# Altium schematic sheet JTAG_UART.SchDoc: Host Interface: JTAG and UART
size Letter; Engineer: Nathan Petersen; DocumentNumber: 21; SheetNumber: 21; SheetTotal: 23
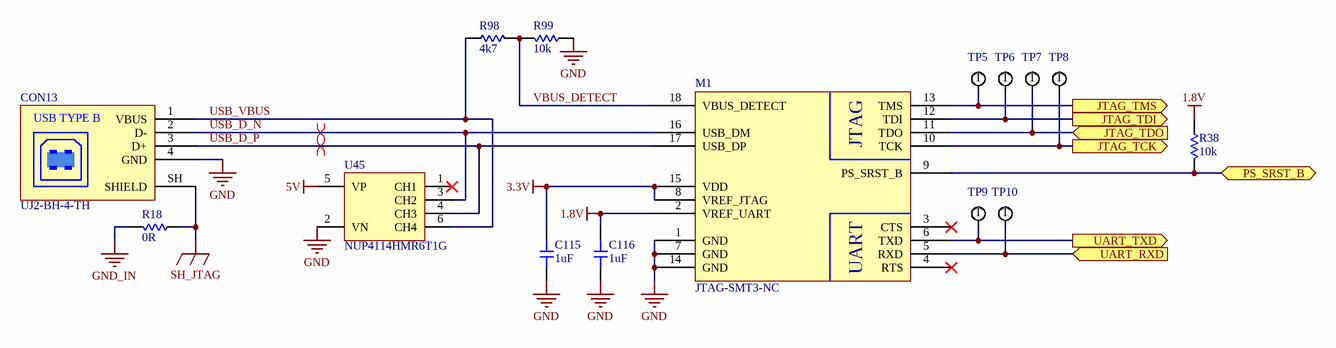
[diagram p0: JTAG_UART.SchDoc]

## Parts
C115  value 1uF  [0603-CAP]  (hidden comment: Capacitor)
C116  value 1uF  [0603-CAP]  (hidden comment: Capacitor)
CON13  UJ2-BH-4-TH  [UJ2-BH-4-TH]
M1  JTAG-SMT3-NC  [JTAG-SMT3-NC]
R18  value 0R  [1206-RES]  (hidden comment: Resistor)
R38  value 10k  [0603-RES]  (hidden comment: Resistor)
R98  value 4k7  [0603-RES]  (hidden comment: Resistor)
R99  value 10k  [0603-RES]  (hidden comment: Resistor)
TP5  Test Point  [TP-125]  (value not drawn)  (no BOM)
TP6  Test Point  [TP-125]  (value not drawn)  (no BOM)
TP7  Test Point  [TP-125]  (value not drawn)  (no BOM)
TP8  Test Point  [TP-125]  (value not drawn)  (no BOM)
TP9  Test Point  [TP-125]  (value not drawn)  (no BOM)
TP10  Test Point  [TP-125]  (value not drawn)  (no BOM)
U45  NUP4114HMR6T1G  [TSOP95P280X110-6N]

## Ports
JTAG_TCK (out), JTAG_TDI (out), JTAG_TDO (in), JTAG_TMS (out), PS_SRST_B (bidir), UART_RXD (in), UART_TXD (out)

## Nets
1.8V: C116.2 M1.2(VREF_UART) R38.1
3.3V: C115.2 M1.8(VREF_JTAG) M1.15(VDD)
5V: U45.5(VP)
GND: C115.1 C116.1 CON13.4(GND) M1.1(GND) M1.7(GND) M1.14(GND) R99.1 U45.2(VN)
GND_IN: R18.2
SH_JTAG: CON13.SH(SHIELD) R18.1
JTAG_TCK: M1.10(TCK) TP8.1 ; port JTAG_TCK
JTAG_TDI: M1.12(TDI) TP6.1 ; port JTAG_TDI
JTAG_TDO: M1.11(TDO) TP7.1 ; port JTAG_TDO
JTAG_TMS: M1.13(TMS) TP5.1 ; port JTAG_TMS
PS_SRST_B: M1.9(PS_SRST_B) R38.2 ; port PS_SRST_B
UART_RXD: M1.5(RXD) TP10.1 ; port UART_RXD
UART_TXD: M1.6(TXD) TP9.1 ; port UART_TXD
USB_D_N: CON13.2(D-) M1.16(USB_DM) U45.3(CH2)
USB_D_P: CON13.3(D+) M1.17(USB_DP) U45.4(CH3)
USB_VBUS: CON13.1(VBUS) R98.1 U45.6(CH4)
VBUS_DETECT: M1.18(VBUS_DETECT) R98.2 R99.2

Not connected (* = marked no-connect by the designer): M1 3(CTS)* 4(RTS)*; U45 1(CH1)*

## Layout directives
differential pair: USB_D_N, USB_D_P

## Notes on the sheet
- Title:
- File:
- Sheet:
- of
- Revision:
- Time:
- Date:
- Engineer:
- (in symbol JTAG-SMT3-NC) JTAG; UART
- (in symbol Test Point) T
- (in symbol UJ2-BH-4-TH) USB TYPE B

## Library data of the parts
CON13 = UJ2-BH-4-TH: CONN RCPT USB2.0 TYPEB 4POS R/A; Supplier 1: Digi-Key; Supplier Part Number 1: 102-5885-ND
M1 = JTAG-SMT3-NC: JTAG-SMT3-NC: SURFACE-MOUNT PROG; Supplier 1: Digi-Key; Supplier Part Number 1: 1286-1196-ND
U45 = NUP4114HMR6T1G: TVS DIODE 5.5V 10V 6TSOP; Supplier 1: Digi-Key; Supplier Part Number 1: NUP4114HMR6T1GOSCT-ND
C115 C116 = Capacitor: Supplier 1: Digi-Key; Supplier Part Number 1: 1276-6524-6-ND
R18 R38 R98 R99 = Resistor: Supplier 1: Digi-Key
  R18: Supplier Part Number 1: 311-0.0ERCT-ND
  R38 R99: Supplier Part Number 1: P10.0KHCT-ND
  R98: Supplier Part Number 1: 311-4.70KHRCT-ND